# Altium schematic sheet xcs6slx25-2csg324i.SchDoc
size D
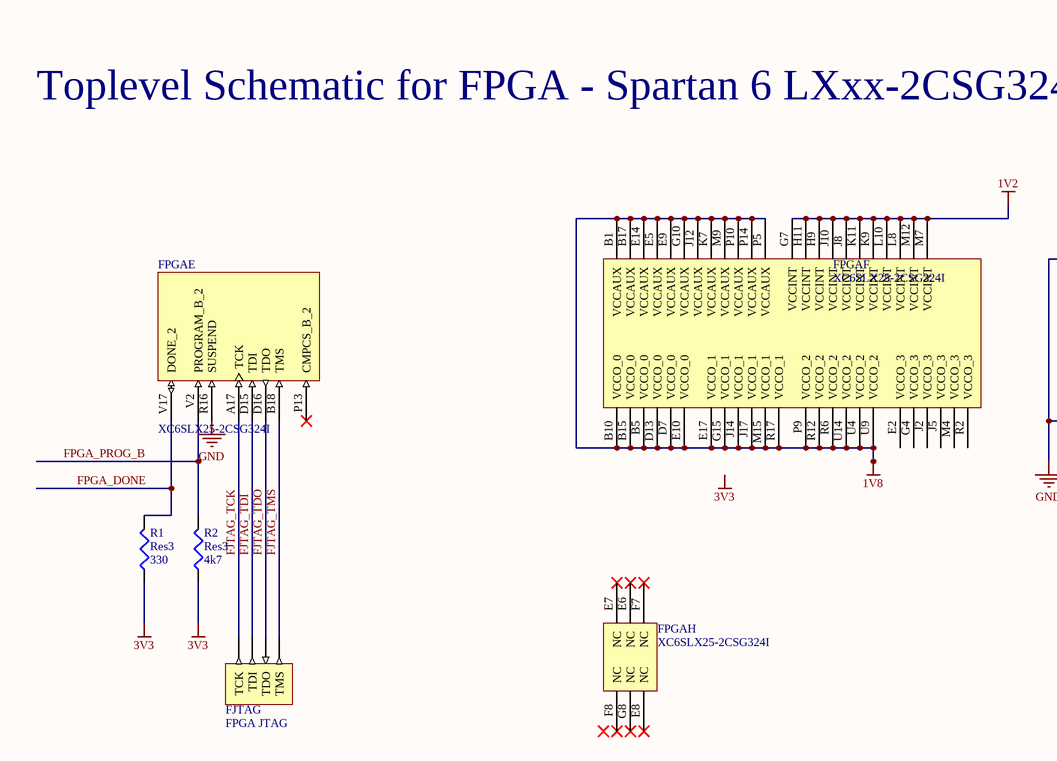
[diagram p0: xcs6slx25-2csg324i.SchDoc, top left]
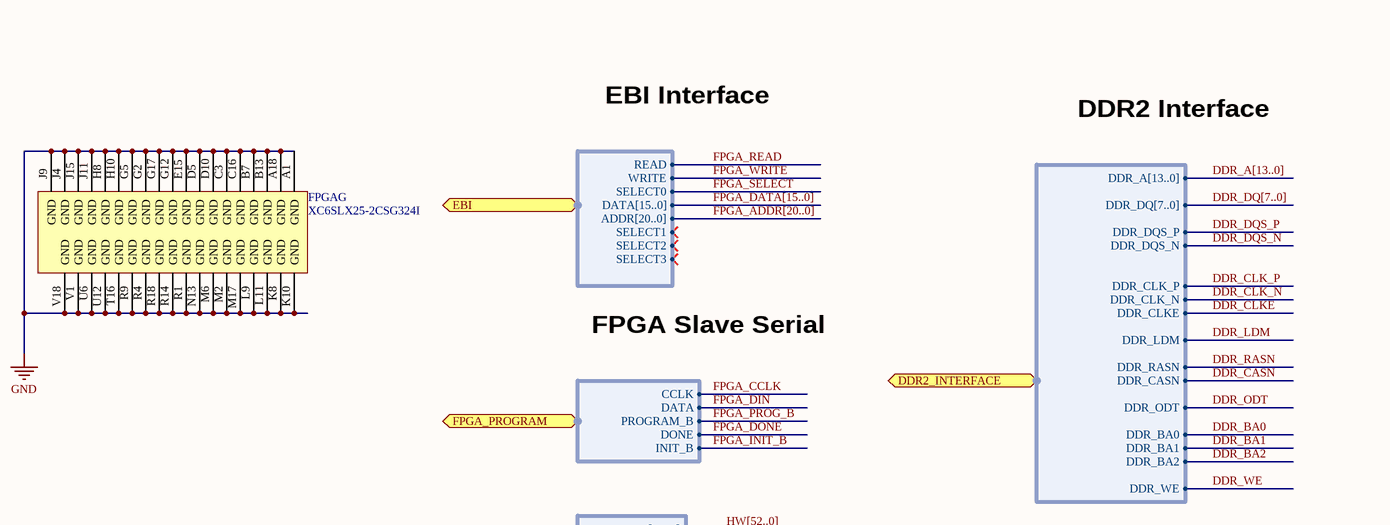
[diagram p1: xcs6slx25-2csg324i.SchDoc, top right]
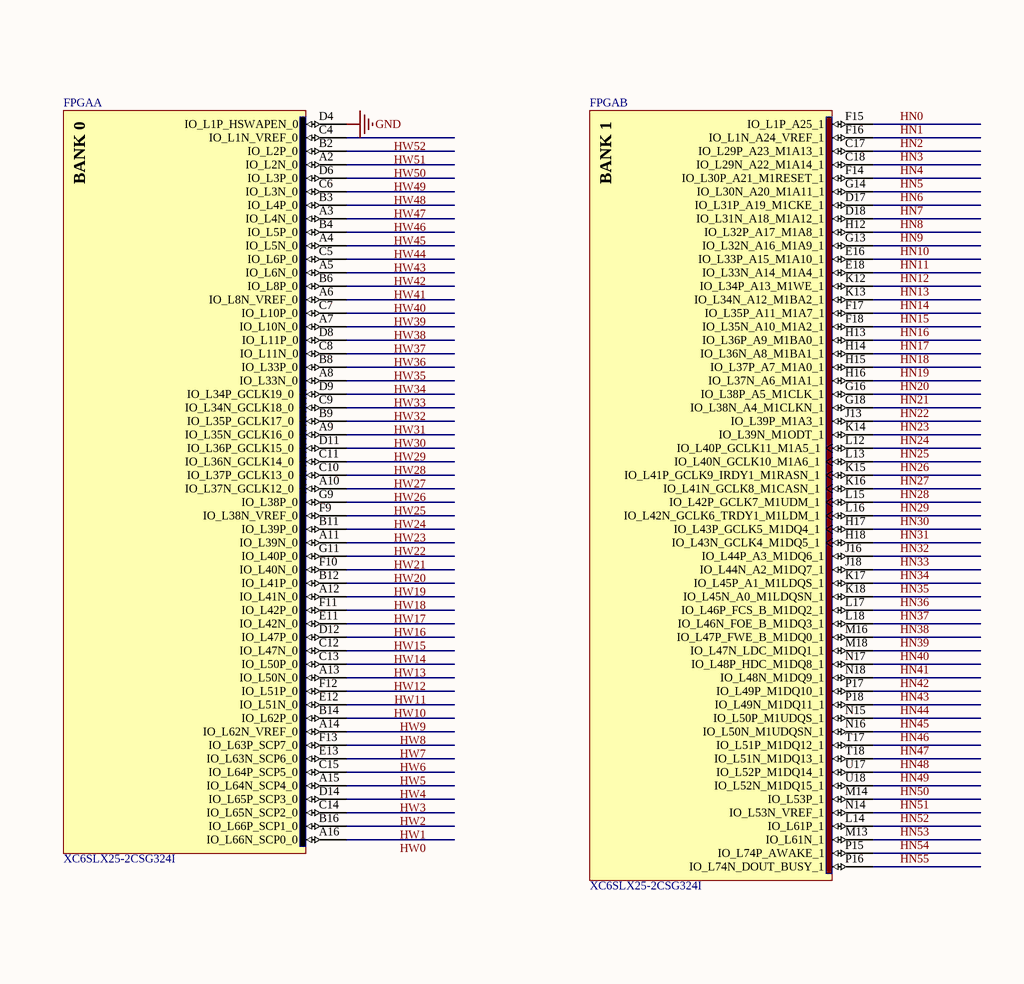
[diagram p2: xcs6slx25-2csg324i.SchDoc, bottom left]
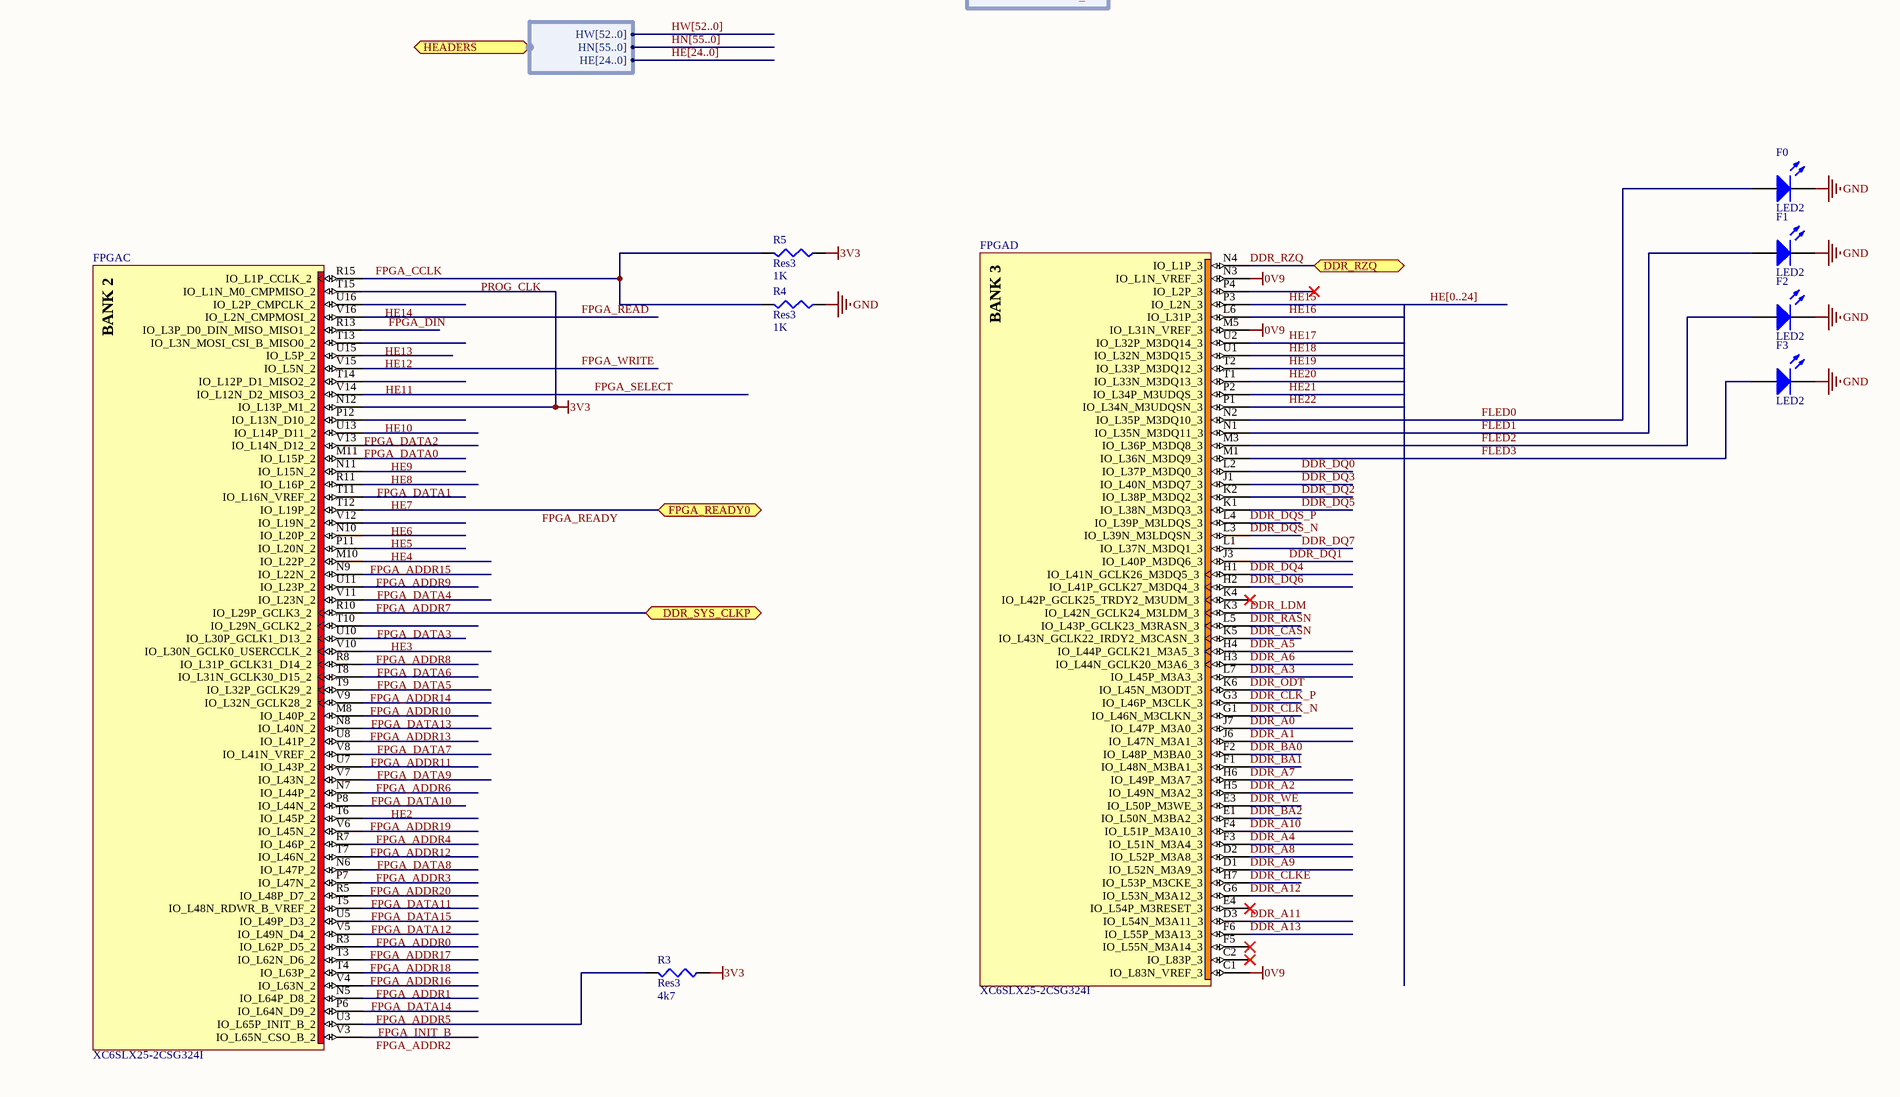
[diagram p3: xcs6slx25-2csg324i.SchDoc, bottom right]

## Parts
F0  LED2  [3.2X1.6X1.1]
F1  LED2  [3.2X1.6X1.1]
F2  LED2  [3.2X1.6X1.1]
F3  LED2  [3.2X1.6X1.1]
FJTAG  FPGA JTAG  [HDR1X4]
FPGA  XC6SLX25-2CSG324I  [CSG324]  (parts A,B,C,D,E,F,G,H of 8)
R1  Res3  value 330  [14-1210]
R2  Res3  value 4k7  [14-1210]
R3  Res3  value 4k7  [14-1210]
R4  Res3  value 1K  [14-1210]
R5  Res3  value 1K  [14-1210]

## Ports
DDR2_INTERFACE (harness DDR2_INTERFACE), DDR_RZQ, DDR_SYS_CLKP, EBI (harness EBI), FPGA_PROGRAM (harness FPGA_SLAVE_SERIAL_PROG), FPGA_READY0, HEADERS (harness HEADERS)

## Harnesses
DDR2_INTERFACE: DDR_A[13..0], DDR_DQ[7..0], DDR_DQS_P, DDR_DQS_N, DDR_CLK_P, DDR_CLK_N, DDR_LDM, DDR_RASN, DDR_CASN, DDR_ODT, DDR_BA0, DDR_BA1, DDR_BA2, DDR_WE, DDR_CLKE
FPGA_SLAVE_SERIAL_PROG: CCLK, DATA, PROGRAM_B, DONE, INIT_B
EBI: READ, WRITE, SELECT0, DATA[15..0], ADDR[20..0], SELECT1, SELECT2, SELECT3
HEADERS: HW[52..0], HN[55..0], HE[24..0]

## Nets
0V9: FPGA.C1(IO_L83N_VREF_3) FPGA.M5(IO_L31N_VREF_3) FPGA.N3(IO_L1N_VREF_3)
1V2: FPGA.G7(VCCINT) FPGA.H9(VCCINT) FPGA.H11(VCCINT) FPGA.J8(VCCINT) FPGA.J10(VCCINT) FPGA.K9(VCCINT) FPGA.K11(VCCINT) FPGA.L8(VCCINT) FPGA.L10(VCCINT) FPGA.M7(VCCINT) FPGA.M12(VCCINT)
1V8: FPGA.B1(VCCAUX) FPGA.B5(VCCO_0) FPGA.B10(VCCO_0) FPGA.B15(VCCO_0) FPGA.B17(VCCAUX) FPGA.D7(VCCO_0) FPGA.D13(VCCO_0) FPGA.E5(VCCAUX) FPGA.E9(VCCAUX) FPGA.E10(VCCO_0) FPGA.E14(VCCAUX) FPGA.E17(VCCO_1) FPGA.G10(VCCAUX) FPGA.G15(VCCO_1) FPGA.J12(VCCAUX) FPGA.J14(VCCO_1) FPGA.J17(VCCO_1) FPGA.K7(VCCAUX) FPGA.M9(VCCAUX) FPGA.M15(VCCO_1) FPGA.P5(VCCAUX) FPGA.P9(VCCO_2) FPGA.P10(VCCAUX) FPGA.P14(VCCAUX) FPGA.R6(VCCO_2) FPGA.R12(VCCO_2) FPGA.R17(VCCO_1) FPGA.U4(VCCO_2) FPGA.U9(VCCO_2) FPGA.U14(VCCO_2)
3V3: FPGA.N12(IO_L13P_M1_2) FPGA.T15(IO_L1N_M0_CMPMISO_2) R1.1 R2.1 R3.1 R5.1
GND: F0.2(K) F1.2(K) F2.2(K) F3.2(K) FPGA.A1(GND) FPGA.A18(GND) FPGA.B7(GND) FPGA.B13(GND) FPGA.C3(GND) FPGA.C16(GND) FPGA.D4(IO_L1P_HSWAPEN_0) FPGA.D5(GND) FPGA.D10(GND) FPGA.E15(GND) FPGA.G2(GND) FPGA.G5(GND) FPGA.G12(GND) FPGA.G17(GND) FPGA.H8(GND) FPGA.H10(GND) FPGA.J4(GND) FPGA.J9(GND) FPGA.J11(GND) FPGA.J15(GND) FPGA.K8(GND) FPGA.K10(GND) FPGA.L9(GND) FPGA.L11(GND) FPGA.M2(GND) FPGA.M6(GND) FPGA.M17(GND) FPGA.N13(GND) FPGA.R1(GND) FPGA.R4(GND) FPGA.R9(GND) FPGA.R14(GND) FPGA.R16(SUSPEND) FPGA.R18(GND) FPGA.T16(GND) FPGA.U6(GND) FPGA.U12(GND) FPGA.V1(GND) FPGA.V18(GND) R4.1
DDR_A0: FPGA.J7(IO_L47P_M3A0_3)
DDR_A1: FPGA.J6(IO_L47N_M3A1_3)
DDR_A2: FPGA.H5(IO_L49N_M3A2_3)
DDR_A3: FPGA.L7(IO_L45P_M3A3_3)
DDR_A4: FPGA.F3(IO_L51N_M3A4_3)
DDR_A5: FPGA.H4(IO_L44P_GCLK21_M3A5_3)
DDR_A6: FPGA.H3(IO_L44N_GCLK20_M3A6_3)
DDR_A7: FPGA.H6(IO_L49P_M3A7_3)
DDR_A8: FPGA.D2(IO_L52P_M3A8_3)
DDR_A9: FPGA.D1(IO_L52N_M3A9_3)
DDR_A10: FPGA.F4(IO_L51P_M3A10_3)
DDR_A11: FPGA.D3(IO_L54N_M3A11_3)
DDR_A12: FPGA.G6(IO_L53N_M3A12_3)
DDR_A13: FPGA.F6(IO_L55P_M3A13_3)
DDR_BA0: FPGA.F2(IO_L48P_M3BA0_3) ; port DDR2_INTERFACE.DDR_BA0
DDR_BA1: FPGA.F1(IO_L48N_M3BA1_3) ; port DDR2_INTERFACE.DDR_BA1
DDR_BA2: FPGA.E1(IO_L50N_M3BA2_3) ; port DDR2_INTERFACE.DDR_BA2
DDR_CASN: FPGA.K5(IO_L43N_GCLK22_IRDY2_M3CASN_3) ; port DDR2_INTERFACE.DDR_CASN
DDR_CLK_N: FPGA.G1(IO_L46N_M3CLKN_3) ; port DDR2_INTERFACE.DDR_CLK_N
DDR_CLK_P: FPGA.G3(IO_L46P_M3CLK_3) ; port DDR2_INTERFACE.DDR_CLK_P
DDR_CLKE: FPGA.H7(IO_L53P_M3CKE_3) ; port DDR2_INTERFACE.DDR_CLKE
DDR_DQ0: FPGA.L2(IO_L37P_M3DQ0_3)
DDR_DQ1: FPGA.J3(IO_L40P_M3DQ6_3)
DDR_DQ2: FPGA.K2(IO_L38P_M3DQ2_3)
DDR_DQ3: FPGA.J1(IO_L40N_M3DQ7_3)
DDR_DQ4: FPGA.H1(IO_L41N_GCLK26_M3DQ5_3)
DDR_DQ5: FPGA.K1(IO_L38N_M3DQ3_3)
DDR_DQ6: FPGA.H2(IO_L41P_GCLK27_M3DQ4_3)
DDR_DQ7: FPGA.L1(IO_L37N_M3DQ1_3)
DDR_DQS_N: FPGA.L3(IO_L39N_M3LDQSN_3) ; port DDR2_INTERFACE.DDR_DQS_N
DDR_DQS_P: FPGA.L4(IO_L39P_M3LDQS_3) ; port DDR2_INTERFACE.DDR_DQS_P
DDR_LDM: FPGA.K3(IO_L42N_GCLK24_M3LDM_3) ; port DDR2_INTERFACE.DDR_LDM
DDR_ODT: FPGA.K6(IO_L45N_M3ODT_3) ; port DDR2_INTERFACE.DDR_ODT
DDR_RASN: FPGA.L5(IO_L43P_GCLK23_M3RASN_3) ; port DDR2_INTERFACE.DDR_RASN
DDR_RZQ: FPGA.N4(IO_L1P_3) ; port DDR_RZQ
DDR_SYS_CLKP: FPGA.R10(IO_L29P_GCLK3_2) ; port DDR_SYS_CLKP
DDR_WE: FPGA.E3(IO_L50P_M3WE_3) ; port DDR2_INTERFACE.DDR_WE
FJTAG_TCK: FJTAG.4(TCK) FPGA.A17(TCK)
FJTAG_TDI: FJTAG.3(TDI) FPGA.D15(TDI)
FJTAG_TDO: FJTAG.2(TDO) FPGA.D16(TDO)
FJTAG_TMS: FJTAG.1(TMS) FPGA.B18(TMS)
FLED0: F0.1(A) FPGA.N2(IO_L35P_M3DQ10_3)
FLED1: F1.1(A) FPGA.N1(IO_L35N_M3DQ11_3)
FLED2: F2.1(A) FPGA.M3(IO_L36P_M3DQ8_3)
FLED3: F3.1(A) FPGA.M1(IO_L36N_M3DQ9_3)
FPGA_ADDR0: FPGA.V5(IO_L49N_D4_2)
FPGA_ADDR1: FPGA.V4(IO_L63N_2)
FPGA_ADDR2: FPGA.V3(IO_L65N_CSO_B_2)
FPGA_ADDR3: FPGA.N6(IO_L47P_2)
FPGA_ADDR4: FPGA.V6(IO_L45N_2)
FPGA_ADDR5: FPGA.P6(IO_L64N_D9_2)
FPGA_ADDR6: FPGA.V7(IO_L43N_2)
FPGA_ADDR7: FPGA.V11(IO_L23N_2)
FPGA_ADDR8: FPGA.V10(IO_L30N_GCLK0_USERCCLK_2)
FPGA_ADDR9: FPGA.N9(IO_L22N_2)
FPGA_ADDR10: FPGA.V9(IO_L32N_GCLK28_2)
FPGA_ADDR11: FPGA.V8(IO_L41N_VREF_2)
FPGA_ADDR12: FPGA.R7(IO_L46P_2)
FPGA_ADDR13: FPGA.N8(IO_L40N_2)
FPGA_ADDR14: FPGA.T9(IO_L32P_GCLK29_2)
FPGA_ADDR15: FPGA.M10(IO_L22P_2)
FPGA_ADDR16: FPGA.T4(IO_L63P_2)
FPGA_ADDR17: FPGA.R3(IO_L62P_D5_2)
FPGA_ADDR18: FPGA.T3(IO_L62N_D6_2)
FPGA_ADDR19: FPGA.T6(IO_L45P_2)
FPGA_ADDR20: FPGA.P7(IO_L47N_2)
FPGA_CCLK: FPGA.R15(IO_L1P_CCLK_2) R4.2 R5.2 ; port FPGA_PROGRAM.CCLK  [also labelled PROG_CLK]
FPGA_DATA0: FPGA.V13(IO_L14N_D12_2)
FPGA_DATA1: FPGA.R11(IO_L16P_2)
FPGA_DATA2: FPGA.U13(IO_L14P_D11_2)
FPGA_DATA3: FPGA.T10(IO_L29N_GCLK2_2)
FPGA_DATA4: FPGA.U11(IO_L23P_2)
FPGA_DATA5: FPGA.T8(IO_L31N_GCLK30_D15_2)
FPGA_DATA6: FPGA.R8(IO_L31P_GCLK31_D14_2)
FPGA_DATA7: FPGA.U8(IO_L41P_2)
FPGA_DATA8: FPGA.T7(IO_L46N_2)
FPGA_DATA9: FPGA.U7(IO_L43P_2)
FPGA_DATA10: FPGA.N7(IO_L44P_2)
FPGA_DATA11: FPGA.R5(IO_L48P_D7_2)
FPGA_DATA12: FPGA.U5(IO_L49P_D3_2)
FPGA_DATA13: FPGA.M8(IO_L40P_2)
FPGA_DATA14: FPGA.N5(IO_L64P_D8_2)
FPGA_DATA15: FPGA.T5(IO_L48N_RDWR_B_VREF_2)
FPGA_DIN: FPGA.R13(IO_L3P_D0_DIN_MISO_MISO1_2) ; port FPGA_PROGRAM.DATA
FPGA_DONE: FPGA.V17(DONE_2) R1.2 ; port FPGA_PROGRAM.DONE
FPGA_INIT_B: FPGA.U3(IO_L65P_INIT_B_2) R3.2 ; port FPGA_PROGRAM.INIT_B
FPGA_PROG_B: FPGA.V2(PROGRAM_B_2) R2.2 ; port FPGA_PROGRAM.PROGRAM_B
FPGA_READ: FPGA.V16(IO_L2N_CMPMOSI_2) ; port EBI.READ
FPGA_READY: FPGA.T12(IO_L19P_2) ; port FPGA_READY0
FPGA_SELECT: FPGA.V14(IO_L12N_D2_MISO3_2) ; port EBI.SELECT0
FPGA_WRITE: FPGA.V15(IO_L5N_2) ; port EBI.WRITE
HE2: FPGA.P8(IO_L44N_2)
HE3: FPGA.U10(IO_L30P_GCLK1_D13_2)
HE4: FPGA.P11(IO_L20N_2)
HE5: FPGA.N10(IO_L20P_2)
HE6: FPGA.V12(IO_L19N_2)
HE7: FPGA.T11(IO_L16N_VREF_2)
HE8: FPGA.N11(IO_L15N_2)
HE9: FPGA.M11(IO_L15P_2)
HE10: FPGA.P12(IO_L13N_D10_2)
HE11: FPGA.T14(IO_L12P_D1_MISO2_2)
HE12: FPGA.U15(IO_L5P_2)
HE13: FPGA.T13(IO_L3N_MOSI_CSI_B_MISO0_2)
HE14: FPGA.U16(IO_L2P_CMPCLK_2)
HE15: FPGA.P3(IO_L2N_3)
HE16: FPGA.L6(IO_L31P_3)
HE17: FPGA.U2(IO_L32P_M3DQ14_3)
HE18: FPGA.U1(IO_L32N_M3DQ15_3)
HE19: FPGA.T2(IO_L33P_M3DQ12_3)
HE20: FPGA.T1(IO_L33N_M3DQ13_3)
HE21: FPGA.P2(IO_L34P_M3UDQS_3)
HE22: FPGA.P1(IO_L34N_M3UDQSN_3)
HN0: FPGA.F15(IO_L1P_A25_1)
HN1: FPGA.F16(IO_L1N_A24_VREF_1)
HN2: FPGA.C17(IO_L29P_A23_M1A13_1)
HN3: FPGA.C18(IO_L29N_A22_M1A14_1)
HN4: FPGA.F14(IO_L30P_A21_M1RESET_1)
HN5: FPGA.G14(IO_L30N_A20_M1A11_1)
HN6: FPGA.D17(IO_L31P_A19_M1CKE_1)
HN7: FPGA.D18(IO_L31N_A18_M1A12_1)
HN8: FPGA.H12(IO_L32P_A17_M1A8_1)
HN9: FPGA.G13(IO_L32N_A16_M1A9_1)
HN10: FPGA.E16(IO_L33P_A15_M1A10_1)
HN11: FPGA.E18(IO_L33N_A14_M1A4_1)
HN12: FPGA.K12(IO_L34P_A13_M1WE_1)
HN13: FPGA.K13(IO_L34N_A12_M1BA2_1)
HN14: FPGA.F17(IO_L35P_A11_M1A7_1)
HN15: FPGA.F18(IO_L35N_A10_M1A2_1)
HN16: FPGA.H13(IO_L36P_A9_M1BA0_1)
HN17: FPGA.H14(IO_L36N_A8_M1BA1_1)
HN18: FPGA.H15(IO_L37P_A7_M1A0_1)
HN19: FPGA.H16(IO_L37N_A6_M1A1_1)
HN20: FPGA.G16(IO_L38P_A5_M1CLK_1)
HN21: FPGA.G18(IO_L38N_A4_M1CLKN_1)
HN22: FPGA.J13(IO_L39P_M1A3_1)
HN23: FPGA.K14(IO_L39N_M1ODT_1)
HN24: FPGA.L12(IO_L40P_GCLK11_M1A5_1)
HN25: FPGA.L13(IO_L40N_GCLK10_M1A6_1)
HN26: FPGA.K15(IO_L41P_GCLK9_IRDY1_M1RASN_1)
HN27: FPGA.K16(IO_L41N_GCLK8_M1CASN_1)
HN28: FPGA.L15(IO_L42P_GCLK7_M1UDM_1)
HN29: FPGA.L16(IO_L42N_GCLK6_TRDY1_M1LDM_1)
HN30: FPGA.H17(IO_L43P_GCLK5_M1DQ4_1)
HN31: FPGA.H18(IO_L43N_GCLK4_M1DQ5_1)
HN32: FPGA.J16(IO_L44P_A3_M1DQ6_1)
HN33: FPGA.J18(IO_L44N_A2_M1DQ7_1)
HN34: FPGA.K17(IO_L45P_A1_M1LDQS_1)
HN35: FPGA.K18(IO_L45N_A0_M1LDQSN_1)
HN36: FPGA.L17(IO_L46P_FCS_B_M1DQ2_1)
HN37: FPGA.L18(IO_L46N_FOE_B_M1DQ3_1)
HN38: FPGA.M16(IO_L47P_FWE_B_M1DQ0_1)
HN39: FPGA.M18(IO_L47N_LDC_M1DQ1_1)
HN40: FPGA.N17(IO_L48P_HDC_M1DQ8_1)
HN41: FPGA.N18(IO_L48N_M1DQ9_1)
HN42: FPGA.P17(IO_L49P_M1DQ10_1)
HN43: FPGA.P18(IO_L49N_M1DQ11_1)
HN44: FPGA.N15(IO_L50P_M1UDQS_1)
HN45: FPGA.N16(IO_L50N_M1UDQSN_1)
HN46: FPGA.T17(IO_L51P_M1DQ12_1)
HN47: FPGA.T18(IO_L51N_M1DQ13_1)
HN48: FPGA.U17(IO_L52P_M1DQ14_1)
HN49: FPGA.U18(IO_L52N_M1DQ15_1)
HN50: FPGA.M14(IO_L53P_1)
HN51: FPGA.N14(IO_L53N_VREF_1)
HN52: FPGA.L14(IO_L61P_1)
HN53: FPGA.M13(IO_L61N_1)
HN54: FPGA.P15(IO_L74P_AWAKE_1)
HN55: FPGA.P16(IO_L74N_DOUT_BUSY_1)
HW0: FPGA.A16(IO_L66N_SCP0_0)
HW1: FPGA.B16(IO_L66P_SCP1_0)
HW2: FPGA.C14(IO_L65N_SCP2_0)
HW3: FPGA.D14(IO_L65P_SCP3_0)
HW4: FPGA.A15(IO_L64N_SCP4_0)
HW5: FPGA.C15(IO_L64P_SCP5_0)
HW6: FPGA.E13(IO_L63N_SCP6_0)
HW7: FPGA.F13(IO_L63P_SCP7_0)
HW8: FPGA.A14(IO_L62N_VREF_0)
HW9: FPGA.B14(IO_L62P_0)
HW10: FPGA.E12(IO_L51N_0)
HW11: FPGA.F12(IO_L51P_0)
HW12: FPGA.A13(IO_L50N_0)
HW13: FPGA.C13(IO_L50P_0)
HW14: FPGA.C12(IO_L47N_0)
HW15: FPGA.D12(IO_L47P_0)
HW16: FPGA.E11(IO_L42N_0)
HW17: FPGA.F11(IO_L42P_0)
HW18: FPGA.A12(IO_L41N_0)
HW19: FPGA.B12(IO_L41P_0)
HW20: FPGA.F10(IO_L40N_0)
HW21: FPGA.G11(IO_L40P_0)
HW22: FPGA.A11(IO_L39N_0)
HW23: FPGA.B11(IO_L39P_0)
HW24: FPGA.F9(IO_L38N_VREF_0)
HW25: FPGA.G9(IO_L38P_0)
HW26: FPGA.A10(IO_L37N_GCLK12_0)
HW27: FPGA.C10(IO_L37P_GCLK13_0)
HW28: FPGA.C11(IO_L36N_GCLK14_0)
HW29: FPGA.D11(IO_L36P_GCLK15_0)
HW30: FPGA.A9(IO_L35N_GCLK16_0)
HW31: FPGA.B9(IO_L35P_GCLK17_0)
HW32: FPGA.C9(IO_L34N_GCLK18_0)
HW33: FPGA.D9(IO_L34P_GCLK19_0)
HW34: FPGA.A8(IO_L33N_0)
HW35: FPGA.B8(IO_L33P_0)
HW36: FPGA.C8(IO_L11N_0)
HW37: FPGA.D8(IO_L11P_0)
HW38: FPGA.A7(IO_L10N_0)
HW39: FPGA.C7(IO_L10P_0)
HW40: FPGA.A6(IO_L8N_VREF_0)
HW41: FPGA.B6(IO_L8P_0)
HW42: FPGA.A5(IO_L6N_0)
HW43: FPGA.C5(IO_L6P_0)
HW44: FPGA.A4(IO_L5N_0)
HW45: FPGA.B4(IO_L5P_0)
HW46: FPGA.A3(IO_L4N_0)
HW47: FPGA.B3(IO_L4P_0)
HW48: FPGA.C6(IO_L3N_0)
HW49: FPGA.D6(IO_L3P_0)
HW50: FPGA.A2(IO_L2N_0)
HW51: FPGA.B2(IO_L2P_0)
HW52: FPGA.C4(IO_L1N_VREF_0)

Not connected (* = marked no-connect by the designer): FPGA C2(IO_L83P_3)* E2(VCCO_3) E4(IO_L54P_M3RESET_3)* E6(NC)* E7(NC)* E8(NC)* F5(IO_L55N_M3A14_3)* F7(NC)* F8(NC)* G4(VCCO_3) G8(NC)* J2(VCCO_3) J5(VCCO_3) K4(IO_L42P_GCLK25_TRDY2_M3UDM_3)* M4(VCCO_3) P4(IO_L2P_3)* P13(CMPCS_B_2)* R2(VCCO_3)

## Buses and harness runs
bus DDR_A[13..0]
bus DDR_DQ[7..0]
bus FPGA_ADDR[20..0]
bus FPGA_DATA[15..0]
bus HE[0..24]
bus HE[24..0]
bus HN[55..0]
bus HW[52..0]

## Notes on the sheet
- Toplevel Schematic for FPGA - Spartan 6 LXxx-2CSG324
- EBI Interface
- DDR2 Interface
- FPGA Slave Serial
- Labels drawn without touching a wire or pin: 3V3
- (in symbol CMP-0067-00428-1, part A) BANK 0
- (in symbol CMP-0067-00428-1, part B) BANK 1
- (in symbol CMP-0067-00428-1, part C) BANK 2
- (in symbol CMP-0067-00428-1, part D) BANK 3

## Library data of the parts
F0-F3 = LED2: Typical RED, GREEN, YELLOW, AMBER GaAs LED; Published: 8-Jun-2000; LatestRevisionDate: 17-Jul-2002; LatestRevisionNote: Re-released for DXP Platform.; PackageVersion: Feb-2002; PackageReference: 3.2X1.6X1.1; Publisher: Altium Limited; PackageDescription: SM LED; 2 Flat Leads
FJTAG = Header 4: Header, 4-Pin; LatestRevisionDate: 17-Jul-2002; LatestRevisionNote: Re-released for DXP Platform.; Publisher: Altium Limited
FPGA = CMP-0067-00428-1: Spartan-6 LX 1.2V FPGA, 226 User I/Os, 324-Ball Chip-Scale BGA (0.8mm Pitch), Speed Grade 2, Industrial Grade, Pb-Free; PackageVersion: ver1.1, Nov-2009; DatasheetVersion: ver1.6, Nov-2010; PackageDescription: 324-Ball Chip-Scale BGA (CSG324) Package, 0.8 mm Pitch; Code_JEDEC: MO-275-KKAC-1; PackageReference: CSG324
R1-R5 = Res3: Resistor; Published: 8-Jun-2000; LatestRevisionDate: 29-May-2009; LatestRevisionNote: IPC-7351 Footprint Added.; PackageReference: J1-0603; Publisher: Altium Limited; PackageDescription: Chip Resistor